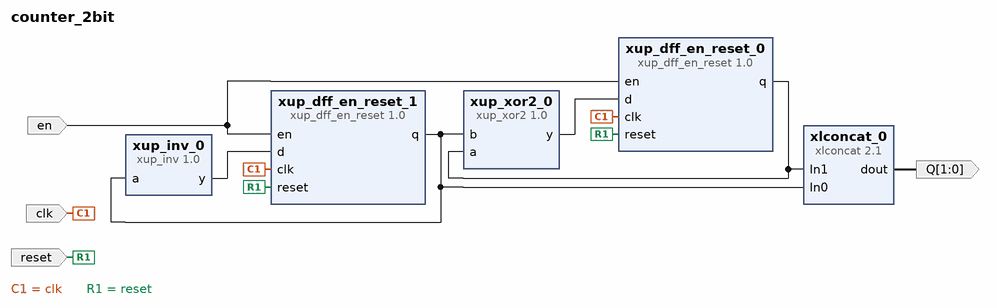
[diagram p0: block diagram of the top level]
# Vivado block design counter_2bit, xc7a35tcpg236-1, Vivado 2018.3
create_bd_design counter_2bit

create_bd_port -dir I clk
create_bd_port -dir I en
create_bd_port -dir I reset
create_bd_port -dir O -from 1 -to 0 Q

create_bd_cell -type ip -vlnv xilinx.com:xup:xup_dff_en_reset:1.0 xup_dff_en_reset_0
set_property -dict {CONFIG.DELAY 0} [get_bd_cells xup_dff_en_reset_0]
create_bd_cell -type ip -vlnv xilinx.com:ip:xlconcat:2.1 xlconcat_0
set_property -dict {CONFIG.NUM_PORTS 2} [get_bd_cells xlconcat_0]
create_bd_cell -type ip -vlnv xilinx.com:xup:xup_dff_en_reset:1.0 xup_dff_en_reset_1
set_property -dict {CONFIG.DELAY 0} [get_bd_cells xup_dff_en_reset_1]
create_bd_cell -type ip -vlnv xilinx.com:xup:xup_xor2:1.0 xup_xor2_0
create_bd_cell -type ip -vlnv xilinx.com:xup:xup_inv:1.0 xup_inv_0

# ---- connections ----

connect_bd_net -net clk_0_1 [get_bd_ports clk] [get_bd_pins xup_dff_en_reset_0/clk] [get_bd_pins xup_dff_en_reset_1/clk]
connect_bd_net -net en_0_1 [get_bd_ports en] [get_bd_pins xup_dff_en_reset_0/en] [get_bd_pins xup_dff_en_reset_1/en]
connect_bd_net -net reset_0_1 [get_bd_ports reset] [get_bd_pins xup_dff_en_reset_0/reset] [get_bd_pins xup_dff_en_reset_1/reset]
connect_bd_net [get_bd_pins xlconcat_0/dout] [get_bd_ports Q]
connect_bd_net [get_bd_pins xup_xor2_0/y] [get_bd_pins xup_dff_en_reset_0/d]
connect_bd_net [get_bd_pins xup_dff_en_reset_0/q] [get_bd_pins xup_xor2_0/a] [get_bd_pins xlconcat_0/In1]
connect_bd_net [get_bd_pins xup_dff_en_reset_1/q] [get_bd_pins xup_inv_0/a] [get_bd_pins xlconcat_0/In0] [get_bd_pins xup_xor2_0/b]
connect_bd_net [get_bd_pins xup_inv_0/y] [get_bd_pins xup_dff_en_reset_1/d]

validate_bd_design
save_bd_design
